# Altium schematic sheet Z.SchDoc
size A4
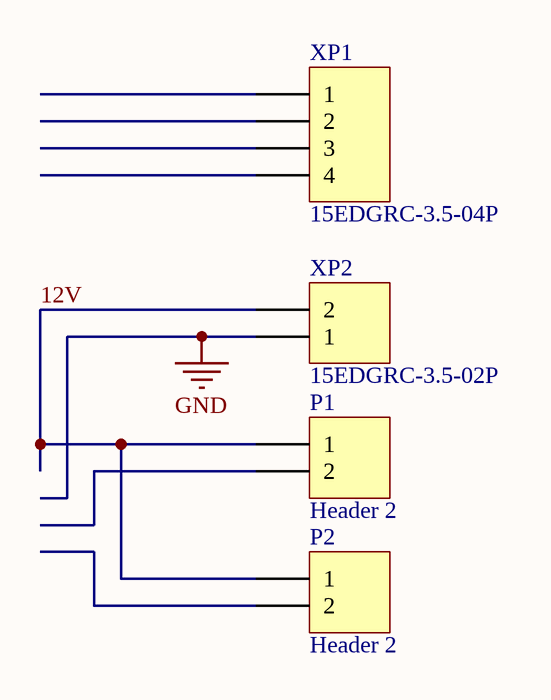
[diagram p0: Z.SchDoc]

## Parts
P1  Header 2  [HDR1X2]
P2  Header 2  [HDR1X2]
XP1  15EDGRC-3.5-04P  [RR_CONN_15EDGRC-3.5-04P]
XP2  15EDGRC-3.5-02P  [RR_CONN_15EDGRC-3.5-02P]

## Nets
GND: XP2.1
12V: P1.1 P2.1 XP2.2

Not connected (* = marked no-connect by the designer): P1 2; P2 2; XP1 1 2 3 4

## Library data of the parts
P1 P2 = Header 2: Header, 2-Pin; LatestRevisionDate: 17-Jul-2002; LatestRevisionNote: Re-released for DXP Platform.; Publisher: Altium Limited
XP1 = 15EDGRC-3.5-04P: CONN 15EDGRC-3.5-04P R-HEADER; Manufacturer: DEGSON ELECTRONICS; Order Number: 15EDGRC-3.5-04P-14-00A(H); Value: Pluggable terminal block; 3.5mm; ways:4; angled 90°; socket; male; Cost: 0,32; Package: 4x3.5MM pitch
XP2 = 15EDGRC-3.5-02P: CONN 15EDGRC-3.5-02P R-HEADER; Manufacturer: DEGSON ELECTRONICS; Order Number: 15EDGRC-3.5-02P-14-00A(H); Value: Pluggable terminal block; 3.5mm; ways:2; angled 90°; socket; male; Cost: 0,32; Package: 2x3.5MM pitch